# EAGLE design ME433_proto_board (EAGLE 5.12)
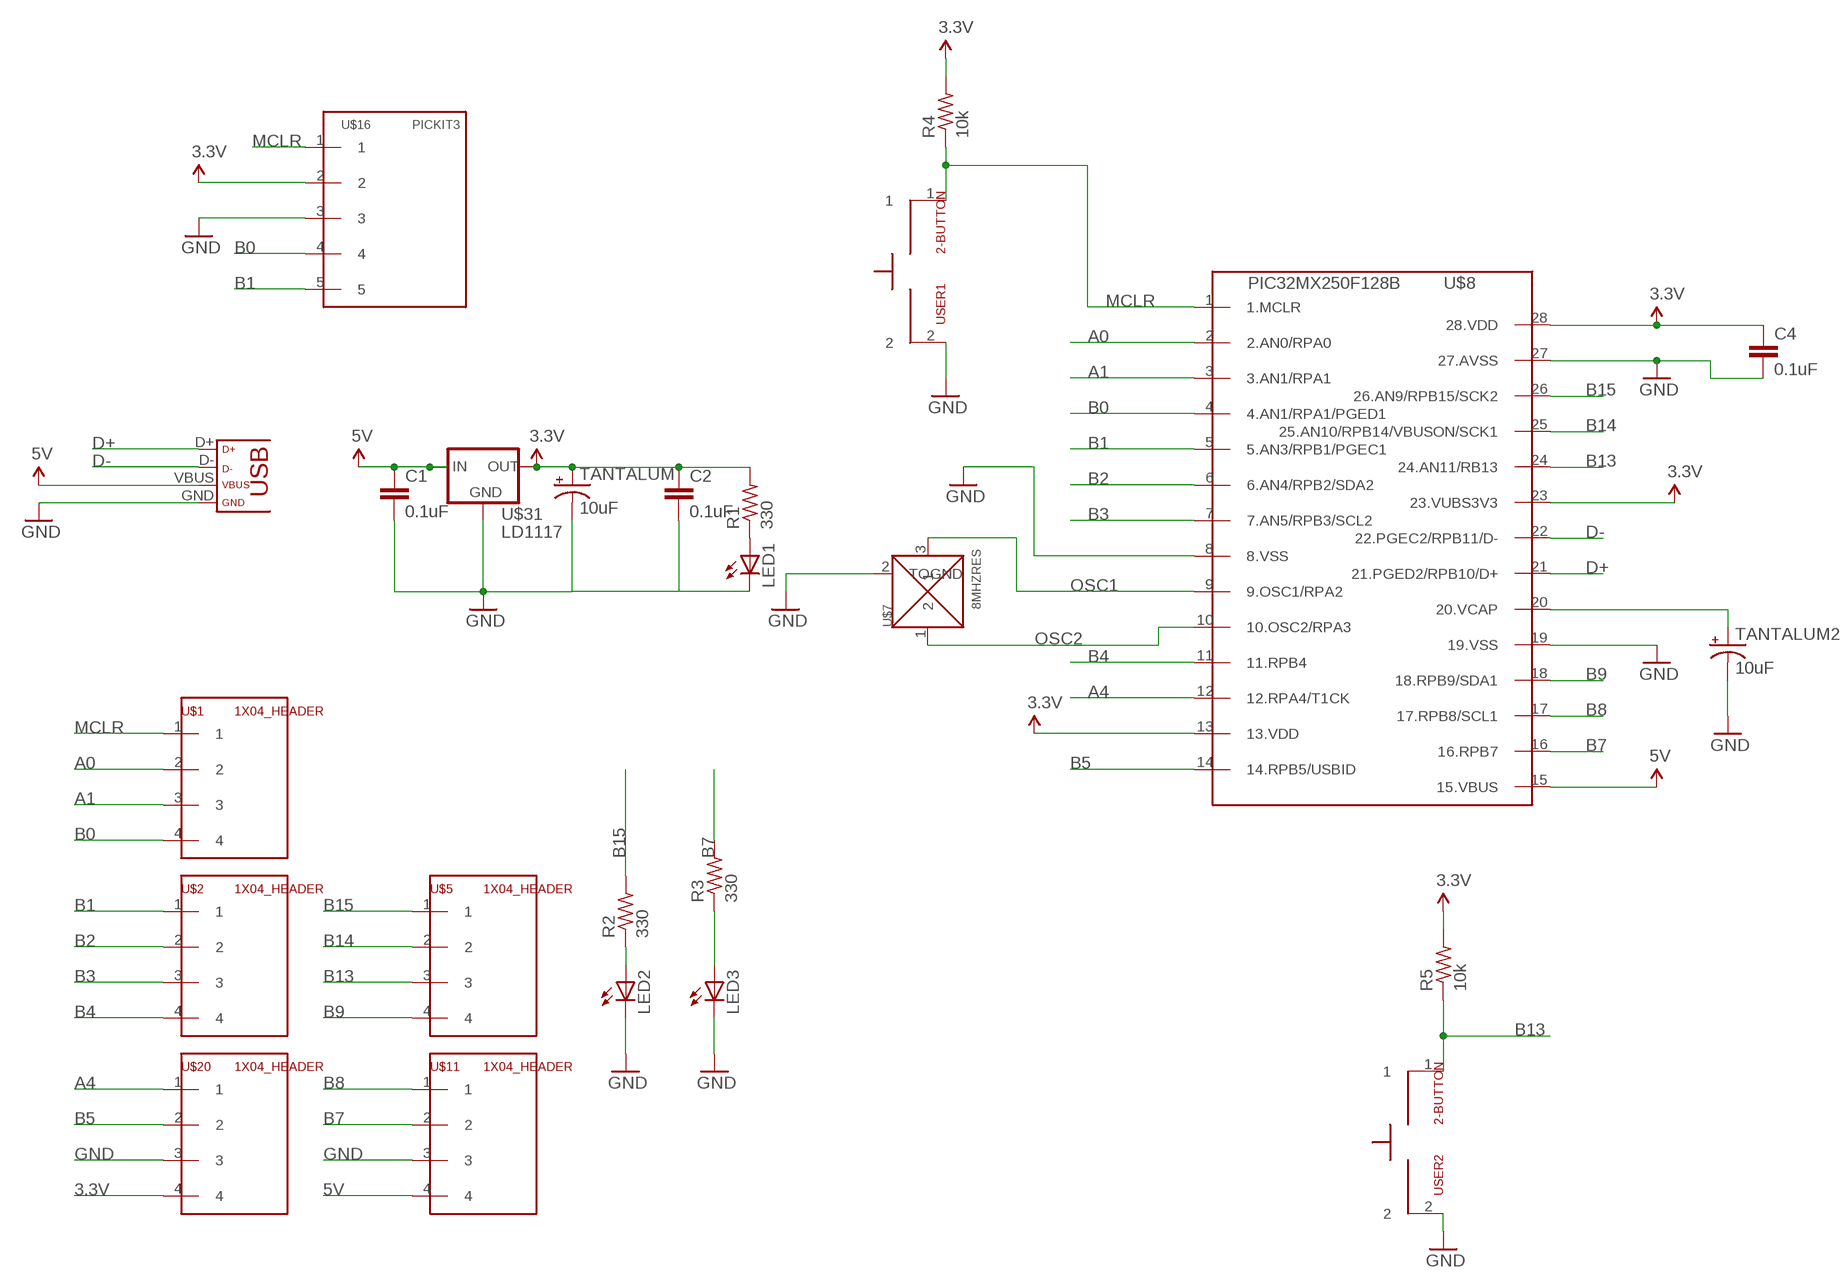
[diagram p0: schematic, sheet 1]

## Parts
C1  0.1uF  C-EU025-024X044  [C025-024X044]
C2  0.1uF  C-EU025-024X044  [C025-024X044]
C4  0.1uF  C-EU025-024X044  [C025-024X044]
LED1  LED  [SMARTLED-TTW]
LED2  LED  [SMARTLED-TTW]
LED3  LED  [SMARTLED-TTW]
R1  330  R-US_0204/5  [0204/5]
R2  330  R-US_0204/5  [0204/5]
R3  330  R-US_0204/5  [0204/5]
R4  10k  R-US_0204/5  [0204/5]
R5  10k  R-US_0204/5  [0204/5]
TANTALUM  10uF  CAP_POL  [CAP_POL_D]
TANTALUM2  10uF  CAP_POL  [CAP_POL_D]
U$1  1X04_HEADER  [1X04]
U$2  1X04_HEADER  [1X04]
U$5  1X04_HEADER  [1X04]
U$7  8MHZRES  8MHZRES8MHZRESNEW  [1X03]
U$8  PIC32MX250F128B  [PIC32MX250F128B]
U$11  1X04_HEADER  [1X04]
U$16  PICKIT3  PICKIT3PICKITNEW  [PICKIT3]
U$20  1X04_HEADER  [1X04]
U$29  USB  [USB-MINIB]
U$31  LD1117  [TO220]
USER1  2-BUTTON  [2-BUTTON]
USER2  2-BUTTON  [2-BUTTON]

## Nets
3.3V: C2.1 C4.1 R1.2 R4.2 R5.2 TANTALUM.1(+) U$8.13(13.VDD) U$8.23(23.VUBS3V3) U$8.28(28.VDD) U$16.2 U$20.4 U$31.2(OUT)
5V: C1.1 U$8.15(15.VBUS) U$11.4 U$29.VBUS U$31.3(IN)
A0: U$1.2 U$8.2(2.AN0/RPA0)
A1: U$1.3 U$8.3(3.AN1/RPA1)
A4: U$8.12(12.RPA4/T1CK) U$20.1
B0: U$1.4 U$8.4(4.AN1/RPA1/PGED1) U$16.4
B1: U$2.1 U$8.5(5.AN3/RPB1/PGEC1) U$16.5
B2: U$2.2 U$8.6(6.AN4/RPB2/SDA2)
B3: U$2.3 U$8.7(7.AN5/RPB3/SCL2)
B4: U$2.4 U$8.11(11.RPB4)
B5: U$8.14(14.RPB5/USBID) U$20.2
B7: R3.2 U$8.16(16.RPB7) U$11.2
B8: U$8.17(17.RPB8/SCL1) U$11.1
B9: U$5.4 U$8.18(18.RPB9/SDA1)
B13: R5.1 U$5.3 U$8.24(24.AN11/RB13) USER2.1
B14: U$5.2 U$8.25(25.AN10/RPB14/VBUSON/SCK1)
B15: R2.2 U$5.1 U$8.26(26.AN9/RPB15/SCK2)
D+: U$8.21(21.PGED2/RPB10/D+) U$29.D+
D-: U$8.22(22.PGEC2/RPB11/D-) U$29.D-
GND: C1.2 C2.2 C4.2 LED1.C@1(C) LED2.C@1(C) LED3.C@1(C) TANTALUM2.2(-) TANTALUM.2(-) U$7.2(TOGND) U$8.8(8.VSS) U$8.19(19.VSS) U$8.27(27.AVSS) U$11.3 U$16.3 U$20.3 U$29.GND U$31.1(GND) USER1.2 USER2.2
MCLR: R4.1 U$1.1 U$8.1(1.MCLR) U$16.1 USER1.1
N$3: LED1.A@1(A) R1.1
N$56: LED2.A@1(A) R2.1
N$57: LED3.A@1(A) R3.1
OSC1: U$7.3 U$8.9(9.OSC1/RPA2)
OSC2: U$7.1 U$8.10(10.OSC2/RPA3)
TANTALUM: TANTALUM2.1(+) U$8.20(20.VCAP)

## Library data of the parts
C1 C2 C4 = resistor:C-EU: CAPACITOR, European symbol
LED1-LED3 = led:LED: LED OSRAM: - CHIPLED LG R971, LG N971, LY N971, LG Q971, LY Q971, LO R971, LY R971 LH N974, LH R974 LS Q976, LO Q976, LY Q976 LO Q996 - Hyper CHIPLED LW Q18S LB Q993, LB Q99A, LB R99A - SideLED LS A670, LO A670, LY A670, LG A670, LP A670 LB A673, LV A673, LT A673, LW A673 LH A674 LY A675 LS A676, LA A676, LO A676, LY A676, LW A676 LS A679, LY A679, LG A679 - Hyper Micro SIDELED® LS Y876, LA Y876, LO Y876, LY Y876 LT Y87S - SmartLED LW L88C, LW L88S LB L89C, LB L89S, LG L890 LS L89K, LO L89K, LY L89K LS L896, LA L896, LO L896, LY L896 - TOPLED LS T670, LO T670, LY T670, LG T670, LP T670 LSG T670, LSP T670, LSY T670, LOP T670, LYG T670 LG T671, LOG T671, LSG T671 LB T673, LV T673, LT T673, LW T673 LH T674 LS T676, LA T676, LO T676, LY T676, LB T676, LH T676, LSB T676, LW T676 LB T67C, LV T67C, LT T67C, LS T67K, LO T67K, LY T67K, LW E67C LS E67B, LA E67B, LO E67B, LY E67B, LB E67C, LV E67C, LT E67C LW T67C LS T679, LY T679, LG T679 LS T770, LO T770, LY T770, LG T770, LP T770 LB T773, LV T773, LT T773, LW T773 LH T774 LS E675, LA E675, LY E675, LS T675 LS T776, LA T776, LO T776, LY T776, LB T776 LHGB T686 LT T68C, LB T68C - Hyper Mini TOPLED® LB M676 - Mini TOPLED Santana® LG M470 LS M47K, LO M47K, LY M47K Source: http://www.osram.convergy.de LUXEON: - LUMILED® LXK2-PW12-R00, LXK2-PW12-S00, LXK2-PW14-U00, LXK2-PW14-V00 LXK2-PM12-R00, LXK2-PM12-S00, LXK2-PM14-U00 LXK2-PE12-Q00, LXK2-PE12-R00, LXK2-PE12-S00, LXK2-PE14-T00, LXK2-PE14-U00 LXK2-PB12-K00, LXK2-PB12-L00, LXK2-PB12-M00, LXK2-PB14-N00, LXK2-PB14-P00, LXK2-PB14-Q00 LXK2-PR12-L00, LXK2-PR12-M00, LXK2-PR14-Q00, LXK2-PR14-R00 LXK2-PD12-Q00, LXK2-PD12-R00, LXK2-PD12-S00 LXK2-PH12-R00, LXK2-PH12-S00 LXK2-PL12-P00, LXK2-PL12-Q00, LXK2-PL12-R00 Source: www.luxeon.com KINGBRIGHT: KA-3528ASYC Source: www.kingbright.com
R1-R5 = resistor:R-US_: RESISTOR, American symbol
TANTALUM TANTALUM2 = ME433:CAP_POL
U$1 U$2 U$5 U$11 U$20 = ME433:1X04_HEADER
U$7 = advanced_mechatronics_library:8MHZRES
U$8 = advanced_mechatronics_library:PIC32MX250F128B
U$16 = advanced_mechatronics_library:PICKIT3
U$29 = ME433:USB
U$31 = ME433:LD1117
USER1 USER2 = advanced_mechatronics_library:2-BUTTON

## Board
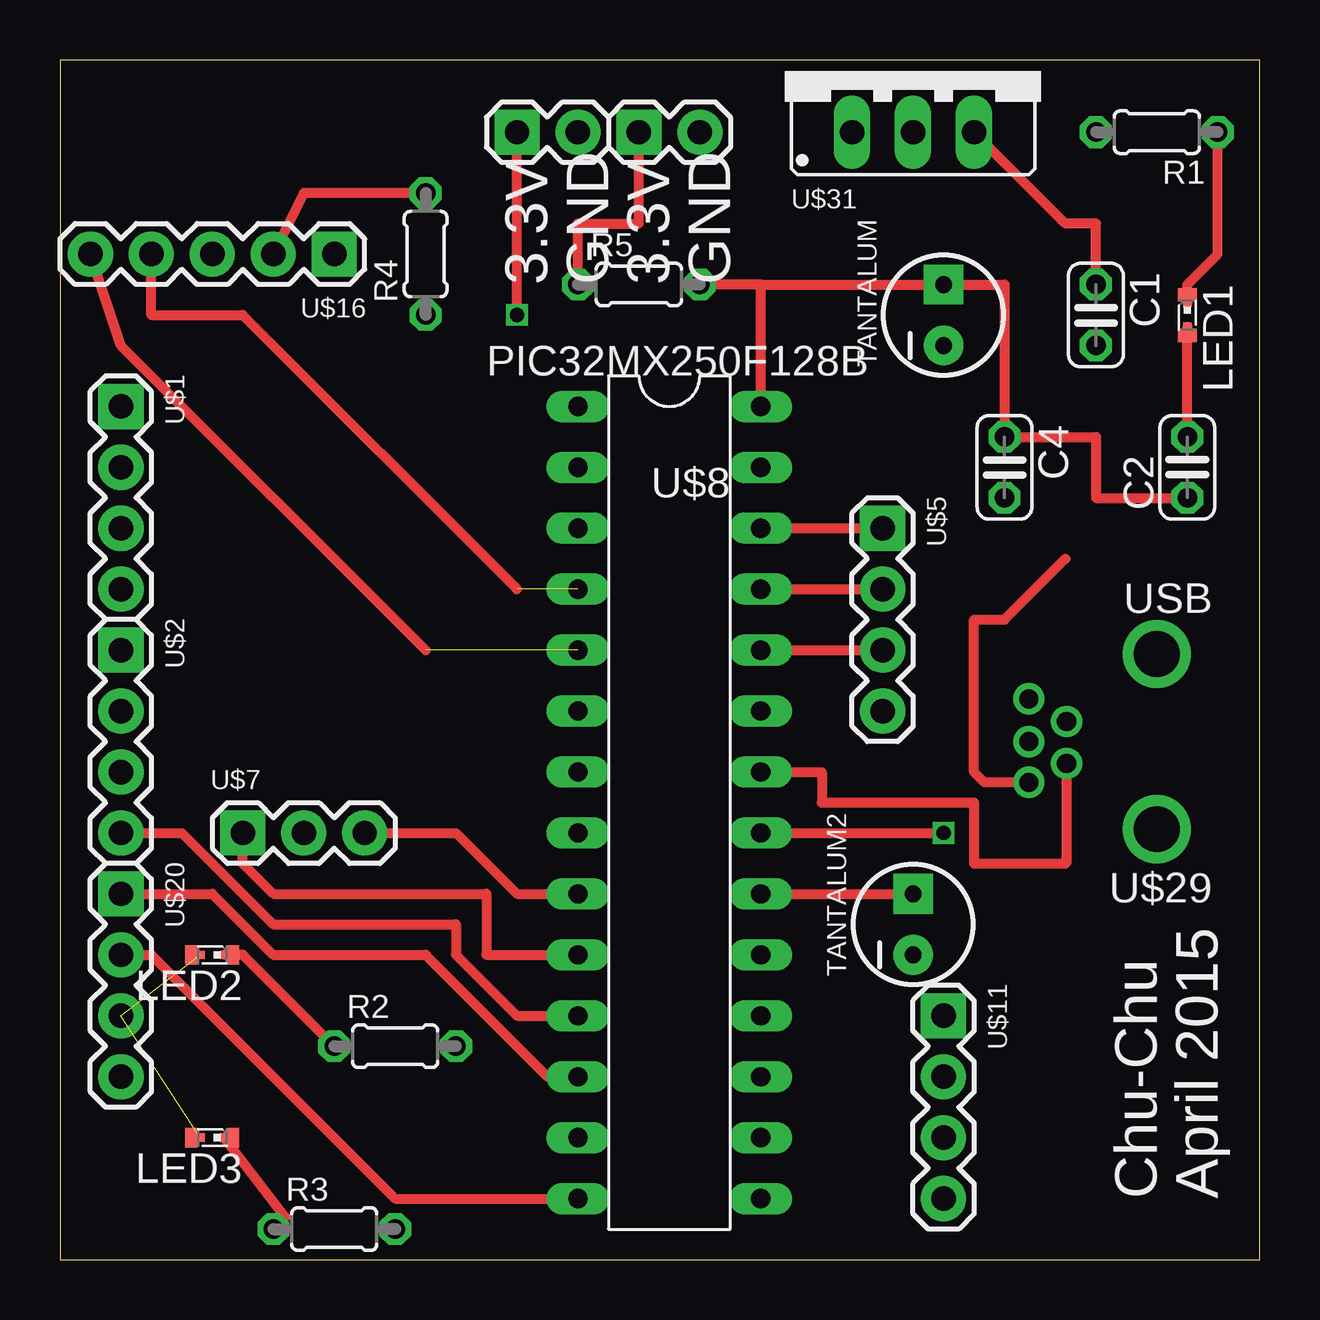
[diagram p1: board, top side]
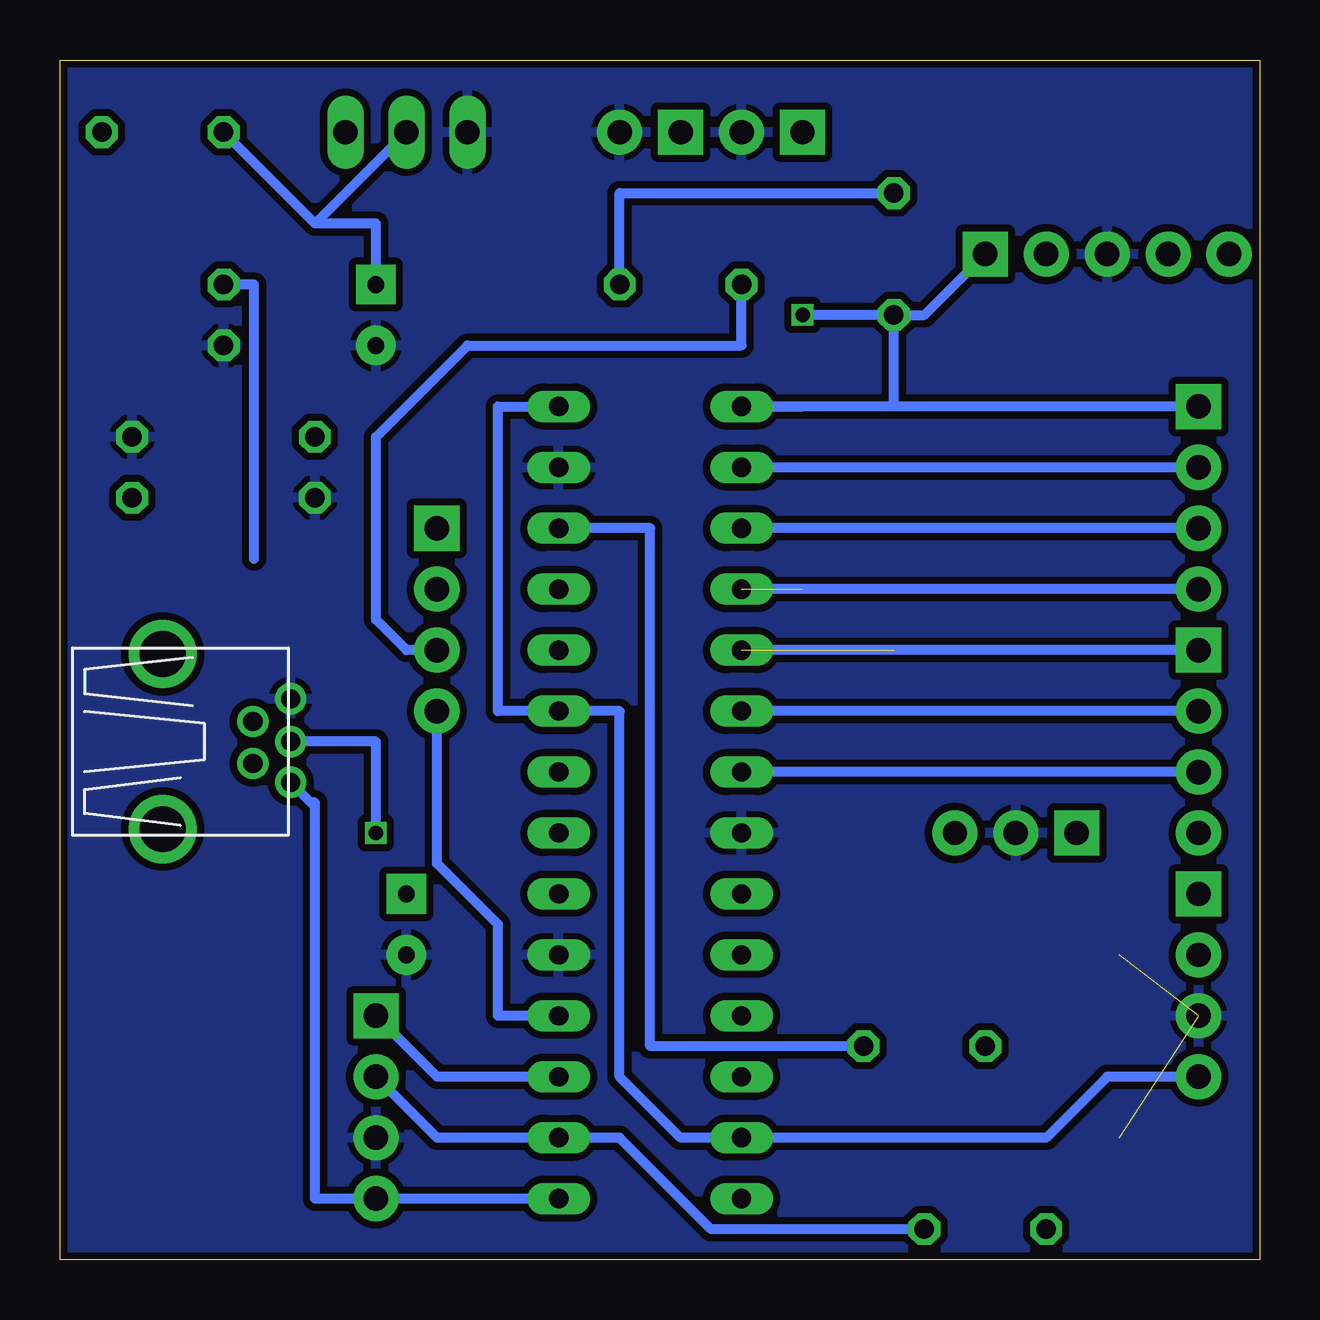
[diagram p2: board, bottom side, seen from below]

Size 50 x 50 mm. Coordinates in mm from the lower left corner, seen from the top.
Outline: 0,0 50,0 50,50 0,50 0,0
Copper layers (1*16): Top 0.035mm / dielectric 1.5mm / Bottom 0.035mm
Design rules "SeeedStudio_2layer_DRU_no_angle_20140221": minimum track width 6mil, minimum drill 12mil, track to track 6mil, track to pad 6mil, pad to pad 6mil, via to via 6mil, smd to smd 0mil, copper to edge 10mil, drill to drill 10mil, minimum pad ring 10mil, minimum via ring 6mil, stop-mask expansion 2mil, vias tented up to drill 100mil, thermal gap 10mil

### Footprints (pad centres in the part's own frame; a part is rotated, then mirrored left to right if it is on the bottom)
C025-024X044 = drill 0.813 octagon: 1 -1.27,0; 2 1.27,0
SMARTLED-TTW = smd 0.8 x 0.5: A 0,-0.875; C 0,0.875 | smd 0.35 x 0.35: A@1 0,-0.5; C@1 0,0.5
0204/5 = drill 0.813 octagon: 1 -2.54,0; 2 2.54,0
CAP_POL_D = drill 0.7 pad 1.651 square: 1 1.27,0 | drill 0.7 pad 1.651 round: 2 -1.27,0
1X04 = drill 1.016 pad 1.88 square: 1 0,0 | drill 1.016 pad 1.88 round: 2 2.54,0; 3 5.08,0; 4 7.62,0
1X03 = drill 1.016 pad 1.88 square: 1 0,0 | drill 1.016 pad 1.88 round: 2 2.54,0; 3 5.08,0
PIC32MX250F128B = drill 0.8 long: 1 -16.51,-3.81; 2 -13.97,-3.81; 3 -11.43,-3.81; 4 -8.89,-3.81; 5 -6.35,-3.81; 6 -3.81,-3.81; 7 -1.27,-3.81; 8 1.27,-3.81; 9 3.81,-3.81; 10 6.35,-3.81; 11 8.89,-3.81; 12 11.43,-3.81; 13 13.97,-3.81; 14 16.51,-3.81; 15 16.51,3.81; 16 13.97,3.81; 17 11.43,3.81; 18 8.89,3.81; 19 6.35,3.81; 20 3.81,3.81; 21 1.27,3.81; 22 -1.27,3.81; 23 -3.81,3.81; 24 -6.35,3.81; 25 -8.89,3.81; 26 -11.43,3.81; 27 -13.97,3.81; 28 -16.51,3.81
PICKIT3 = drill 1.016 pad 1.88 square: 1 0,0 | drill 1.016 pad 1.88 round: 2 2.54,0; 3 5.08,0; 4 7.62,0; 5 10.16,0
USB-MINIB = drill 0.8 round: D+ 4.064,0; D- 2.489,0.914; GND 4.064,-1.778; ID 2.489,-0.838; VBUS 4.064,1.702 | drill 1.9 round: P$6 -1.27,-3.65; P$7 -1.27,3.65
TO220 = drill 1.016 long: 1 -2.54,0; 2 0,0; 3 2.54,0
2-BUTTON = drill 1.016 pad 1.88 square: 1 0,0 | drill 1.016 pad 1.88 round: 2 2.54,0

### Placement (x,y rotation side)
C1  43.18,39.37 270 top
C2  46.99,33.02 90 top
C4  39.37,33.02 270 top
LED1  46.99,39.37 180 top
LED2  6.35,12.7 90 top
LED3  6.35,5.08 90 top
R1  45.72,46.99 180 top
R2  13.97,8.89 0 top
R3  11.43,1.27 0 top
R4  15.24,41.91 90 top
R5  24.13,40.64 0 top
TANTALUM  36.83,39.37 90 top
TANTALUM2  35.56,13.97 90 top
U$1  2.54,35.56 270 top
U$2  2.54,25.4 270 top
U$5  34.29,30.48 270 top
U$7  7.62,17.78 0 top
U$8  25.4,19.05 270 top
U$11  36.83,10.16 270 top
U$16  11.43,41.91 180 top
U$20  2.54,15.24 270 top
U$29  44.45,21.59 180 top
U$31  35.56,46.99 0 top
USER1  19.05,46.99 0 top
USER2  24.13,46.99 0 top

### Tracks (layer width: path | path; a pad name or v marks a point on that pad's centre or on a via)
3.3V
  Top 0.406: R4.2 10.16,44.45 U$16.2 | U$8.28 29.21,40.64 | 29.21,40.64 R5.2 | 29.21,40.64 TANTALUM.1 39.37,40.64 C4.1 43.18,34.29 43.18,31.75 C2.1
  Bottom 0.406: U$20.4 6.35,7.62 8.89,5.08 U$8.13 24.13,5.08 26.67,7.62 26.67,22.86 U$8.23 31.75,22.86 31.75,35.56 U$8.28 | R4.2 26.67,44.45 R5.2 | 39.37,43.18 U$31.2 | 39.37,43.18 R1.2 | 39.37,43.18 36.83,43.18 TANTALUM.1
5V  (1 unrouted)
  Top 0.406: U$31.3 41.91,43.18 43.18,43.18 C1.1 | U$29.VBUS 38.53,19.89 38.1,20.32 38.1,26.67 39.37,26.67 41.91,29.21
  Bottom 0.406: U$8.15 U$11.4 39.37,2.54 39.37,19.05 39.55,19.05 U$29.VBUS | 41.91,29.21 41.91,40.64 C1.1
A0
  Bottom 0.406: U$1.2 U$8.2
A1
  Bottom 0.406: U$1.3 U$8.3
A4
  Top 0.406: U$20.1 6.35,15.24 8.89,12.7 15.24,12.7 20.32,7.62 U$8.12
B0  (1 unrouted)
  Top 0.406: U$16.4 3.81,39.37 7.62,39.37 19.05,27.94
  Bottom 0.406: U$1.4 U$8.4
B1  (1 unrouted)
  Top 0.406: U$16.5 2.54,38.1 15.24,25.4
  Bottom 0.406: U$2.1 U$8.5
B2
  Bottom 0.406: U$2.2 U$8.6
B3
  Bottom 0.406: U$2.3 U$8.7
B4
  Top 0.406: U$2.4 5.08,17.78 8.89,13.97 16.51,13.97 16.51,12.7 19.05,10.16 U$8.11
B5
  Top 0.406: U$20.2 3.81,12.7 13.97,2.54 U$8.14
B7
  Bottom 0.406: U$11.2 34.29,5.08 U$8.16 26.67,5.08 22.86,1.27 R3.2
B8
  Bottom 0.406: U$8.17 34.29,7.62 U$11.1
B9
  Bottom 0.406: U$8.18 31.75,10.16 31.75,13.97 34.29,16.51 U$5.4
B13
  Top 0.406: U$8.24 U$5.3 | R5.1 21.59,43.18 24.13,43.18 USER2.1
  Bottom 0.406: R5.1 21.59,38.1 33.02,38.1 36.83,34.29 36.83,26.67 35.56,25.4 U$5.3
B14
  Top 0.406: U$8.25 U$5.2
B15
  Top 0.406: U$8.26 U$5.1
  Bottom 0.406: R2.2 25.4,8.89 25.4,30.48 U$8.26
D+  (via drill 0.6)
  Top 0.406: U$8.21 v36.83,17.78
  Bottom 0.406: v36.83,17.78 36.83,21.59 U$29.D+
D-
  Top 0.406: U$29.D- 41.96,16.56 41.91,16.51 38.1,16.51 38.1,19.05 31.75,19.05 31.75,20.32 U$8.22
GND  (2 unrouted)
  Top 0.406: C2.2 LED1.C@1
  pour Bottom (isolate 0.305): 0,49.53 0,0 49.53,0 49.53,49.53
MCLR  (via drill 0.6)
  Top 0.406: v19.05,39.37 USER1.1
  Bottom 0.406: U$1.1 15.24,35.56 | 15.24,35.56 U$8.1 19.05,35.56 | R4.1 v19.05,39.37 | 15.24,35.56 R4.1 | R4.1 13.97,39.37 U$16.1
N$3
  Top 0.406: LED1.A@1 46.99,40.64 48.26,41.91 R1.1
N$56
  Top 0.406: LED2.A@1 7.62,12.7 R2.1
N$57
  Top 0.406: LED3.A@1 9.39,1.77 R3.1
OSC1
  Top 0.406: U$7.3 16.51,17.78 19.05,15.24 U$8.9
OSC2
  Top 0.406: U$7.1 7.62,16.51 8.89,15.24 17.78,15.24 17.78,12.7 U$8.10
TANTALUM
  Top 0.406: U$8.20 TANTALUM2.1

### Text on the board
tPlace: Chu-Chu | April 2015
tNames: 3.3V | GND | 3.3V | GND